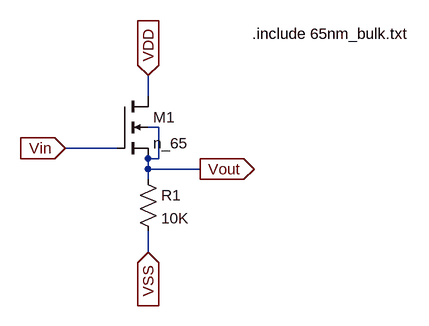
[diagram p0: schematic VF.asc]
VF.asc, the LTspice schematic file:
Version 4.1
SHEET 1 880 680
WIRE 128 80 128 48
WIRE 144 128 128 128
WIRE 80 160 0 160
WIRE 144 176 144 128
WIRE 144 176 128 176
WIRE 128 192 128 176
WIRE 208 192 128 192
WIRE 128 208 128 192
WIRE 128 320 128 288
FLAG 128 320 VSS
IOPIN 128 320 In
FLAG 0 160 Vin
IOPIN 0 160 In
FLAG 128 48 VDD
IOPIN 128 48 In
FLAG 208 192 Vout
IOPIN 208 192 Out
SYMBOL nmos4 80 80 R0
SYMATTR InstName M1
SYMATTR Value n_65
SYMATTR Value2 l=65n w=120u
SYMBOL res 112 192 R0
SYMATTR InstName R1
SYMATTR Value 10K
TEXT 288 -16 Left 2 !.include 65nm_bulk.txt

The netlist it stands for:
* VF.asc
M1 VDD Vin Vout Vout n_65 l=65n w=120u
R1 Vout VSS 10K
.model NMOS NMOS
.model PMOS PMOS
.lib standard.mos
.include 65nm_bulk.txt
.backanno
.end